# EAGLE design SupergunBasic (EAGLE 9.4.0)
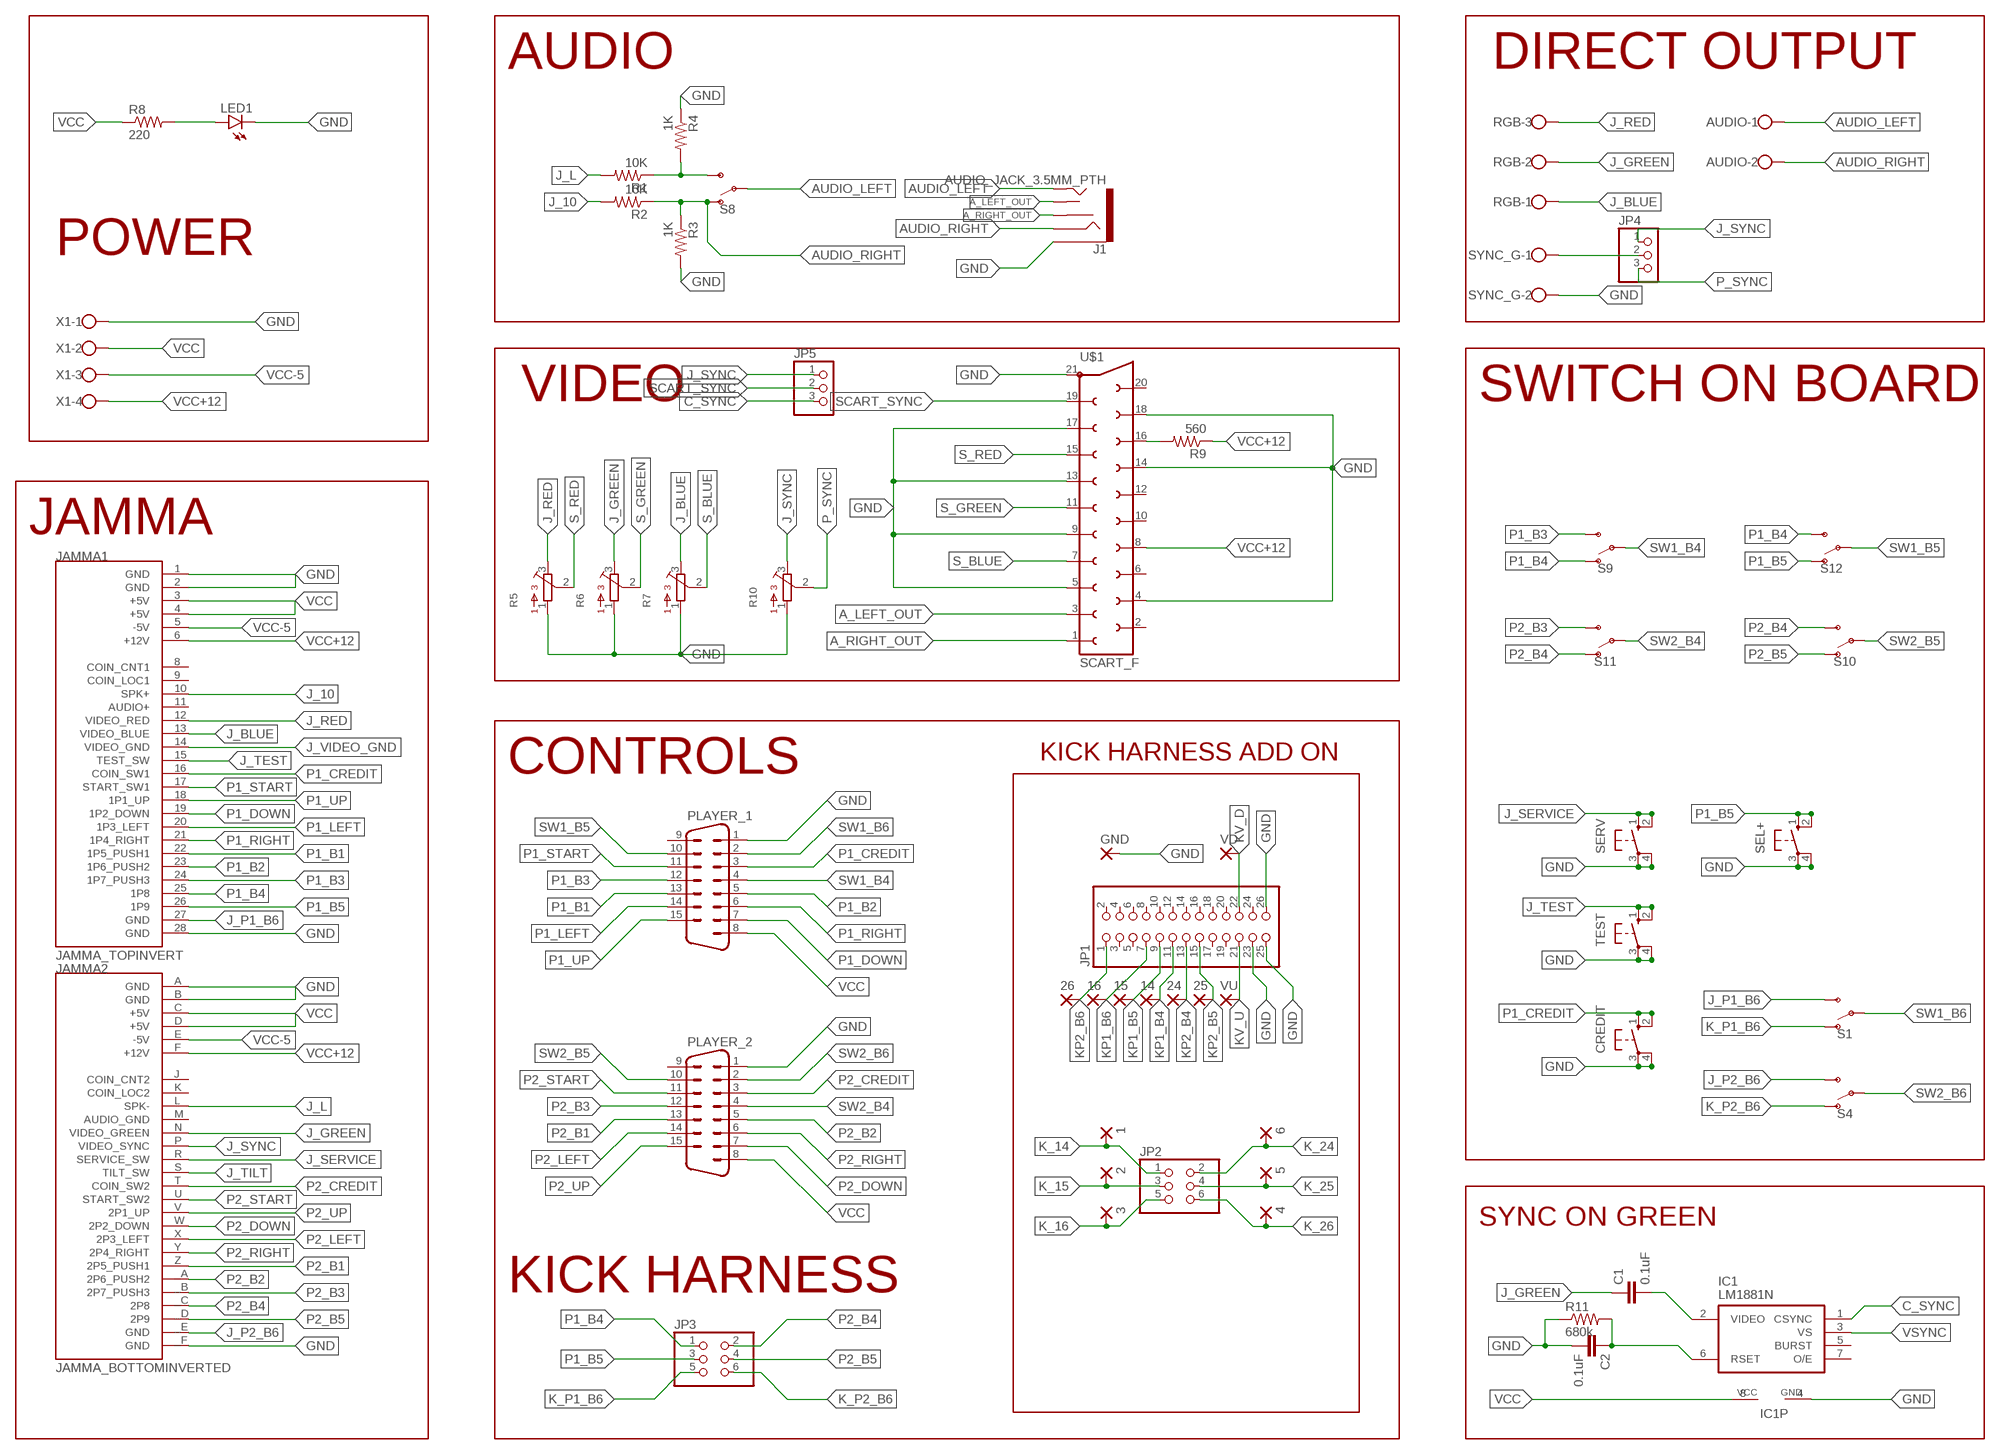
[diagram p0: schematic, sheet 1]

## Parts
1  SMD2  [SMD1,27-2,54]
2  SMD2  [SMD1,27-2,54]
3  SMD2  [SMD1,27-2,54]
4  SMD2  [SMD1,27-2,54]
5  SMD2  [SMD1,27-2,54]
6  SMD2  [SMD1,27-2,54]
14  SMD2  [SMD1,27-2,54]
15  SMD2  [SMD1,27-2,54]
16  SMD2  [SMD1,27-2,54]
24  SMD2  [SMD1,27-2,54]
25  SMD2  [SMD1,27-2,54]
26  SMD2  [SMD1,27-2,54]
AUDIO  W237-102  [W237-102]
C1  0.1uF  0.1UF-KIT-EZ-50V-20%  [CAP-PTH-SMALL-KIT]
C2  0.1uF  0.1UF-KIT-EZ-50V-20%  [CAP-PTH-SMALL-KIT]
CREDIT  10-XX  [B3F-10XX]
GND  SMD2  [SMD1,27-2,54]
IC1  LM1881N  [DIL08]
J1  AUDIO_JACK_3.5MM_PTH  [AUDIO-JACK]
JAMMA1  JAMMA_TOPINVERT  [JAMMA_TOP_INV]
JAMMA2  JAMMA_BOTTOMINVERTED  [JAMMA_BOTTOM_INV]
JP1  PINHD-2X13  [2X13]
JP2  PINHD-2X3  [2X03]
JP3  PINHD-2X3  [2X03]
JP4  PINHD-1X3  [1X03]
JP5  PINHD-1X3  [1X03]
LED1  LEDLD260  [LD260]
PLAYER_1  M15HP  [M15HP]
PLAYER_2  M15HP  [M15HP]
R1  10K  R-US_0204/7  [0204/7]
R2  10K  R-US_0204/7  [0204/7]
R3  1K  R-US_0204/7  [0204/7]
R4  1K  R-US_0204/7  [0204/7]
R5  3362P  [3362P]
R6  3362P  [3362P]
R7  3362P  [3362P]
R8  220  R-US_0204/7  [0204/7]
R9  560  R-US_0204/7  [0204/7]
R10  3362P  [3362P]
R11  680k  R-US_0204/7  [0204/7]
RGB  W237-103  [W237-103]
S1  SWITCH-SPDT-PTH-11.6X4.0MM  [SWITCH_SPDT_PTH_11.6X4.0MM]
S4  SWITCH-SPDT-PTH-11.6X4.0MM  [SWITCH_SPDT_PTH_11.6X4.0MM]
S8  SWITCH-SPDT-PTH-11.6X4.0MM  [SWITCH_SPDT_PTH_11.6X4.0MM]
S9  SWITCH-SPDT-PTH-11.6X4.0MM  [SWITCH_SPDT_PTH_11.6X4.0MM]
S10  SWITCH-SPDT-PTH-11.6X4.0MM  [SWITCH_SPDT_PTH_11.6X4.0MM]
S11  SWITCH-SPDT-PTH-11.6X4.0MM  [SWITCH_SPDT_PTH_11.6X4.0MM]
S12  SWITCH-SPDT-PTH-11.6X4.0MM  [SWITCH_SPDT_PTH_11.6X4.0MM]
SEL+  10-XX  [B3F-10XX]
SERV  10-XX  [B3F-10XX]
SYNC_G  W237-102  [W237-102]
TEST  10-XX  [B3F-10XX]
U$1  SCART_F  [SCART_F]
VD  SMD2  [SMD1,27-2,54]
VU  SMD2  [SMD1,27-2,54]
X1  W237-4  [W237-4]

## Nets
A_LEFT_OUT: J1.TSH U$1.3
A_RIGHT_OUT: J1.RSH U$1.1
AUDIO_LEFT: AUDIO.1 J1.TIP S8.2(P)
AUDIO_RIGHT: AUDIO.2 J1.RING R2.1 R3.1 S8.1(O)
C_SYNC: IC1.1(CSYNC) JP5.3
DIRECT_SYNC: JP4.2 SYNC_G.1
GND [GND]: C2.2 CREDIT.3(P) CREDIT.4(P1) GND.1(P) IC1.4(GND) J1.SLEEVE JAMMA1.1(GND) JAMMA1.2(GND) JAMMA1.28(GND) JAMMA2._F(GND) JAMMA2.A(GND) JAMMA2.B(GND) JP1.23 JP1.25 JP1.26 LED1.K(C) PLAYER_1.1 PLAYER_2.1 R3.2 R4.1 R5.1 R6.1 R7.1 R10.1 R11.1 SEL+.3(P) SEL+.4(P1) SERV.3(P) SERV.4(P1) SYNC_G.2 TEST.3(P) TEST.4(P1) U$1.4 U$1.5 U$1.9 U$1.13 U$1.14 U$1.17 U$1.18 U$1.21 X1.1
J_10: JAMMA1.10(SPK+) R2.2
J_BLUE: JAMMA1.13(VIDEO_BLUE) R7.3 RGB.1
J_GREEN: C1.1 JAMMA2.N(VIDEO_GREEN) R6.3 RGB.2
J_L: JAMMA2.L(SPK-) R1.2
J_P1_B6: JAMMA1.27(GND) S1.3(S)
J_P2_B6: JAMMA2._E(GND) S4.3(S)
J_RED: JAMMA1.12(VIDEO_RED) R5.3 RGB.3
J_SERVICE: JAMMA2.R(SERVICE_SW) SERV.1(S) SERV.2(S1)
J_SYNC: JAMMA2.P(VIDEO_SYNC) JP4.1 JP5.1 R10.3
J_TEST: JAMMA1.15(TEST_SW) TEST.1(S) TEST.2(S1)
J_TILT: JAMMA2.S(TILT_SW)
J_VIDEO_GND [GND]: JAMMA1.14(VIDEO_GND)
K_14: 1.1(P) JP2.1
K_15: 2.1(P) JP2.3
K_16: 3.1(P) JP2.5
K_24: 6.1(P) JP2.2
K_25: 5.1(P) JP2.4
K_26: 4.1(P) JP2.6
K_P1_B6: JP3.5 S1.1(O)
K_P2_B6: JP3.6 S4.1(O)
KP1_B4: 14.1(P) JP1.11
KP1_B5: 15.1(P) JP1.9
KP1_B6: 16.1(P) JP1.7
KP2_B4: 24.1(P) JP1.13
KP2_B5: 25.1(P) JP1.15
KP2_B6: 26.1(P) JP1.1
KV_D: JP1.22 VD.1(P)
KV_U: JP1.21 VU.1(P)
N$2: LED1.A R8.2
N$4: C2.1 IC1.6(RSET) R11.2
N$5: C1.2 IC1.2(VIDEO)
P1_B1: JAMMA1.22(1P5_PUSH1) PLAYER_1.13
P1_B2: JAMMA1.23(1P6_PUSH2) PLAYER_1.5
P1_B3: JAMMA1.24(1P7_PUSH3) PLAYER_1.12 S9.3(S)
P1_B4: JAMMA1.25(1P8) JP3.1 S9.1(O) S12.3(S)
P1_B5: JAMMA1.26(1P9) JP3.3 S12.1(O) SEL+.1(S) SEL+.2(S1)
P1_CREDIT: CREDIT.1(S) CREDIT.2(S1) JAMMA1.16(COIN_SW1) PLAYER_1.3
P1_DOWN: JAMMA1.19(1P2_DOWN) PLAYER_1.7
P1_LEFT: JAMMA1.20(1P3_LEFT) PLAYER_1.14
P1_RIGHT: JAMMA1.21(1P4_RIGHT) PLAYER_1.6
P1_START: JAMMA1.17(START_SW1) PLAYER_1.11
P1_UP: JAMMA1.18(1P1_UP) PLAYER_1.15
P2_B1: JAMMA2.Z(2P5_PUSH1) PLAYER_2.13
P2_B2: JAMMA2._A(2P6_PUSH2) PLAYER_2.5
P2_B3: JAMMA2._B(2P7_PUSH3) PLAYER_2.12 S11.3(S)
P2_B4: JAMMA2._C(2P8) JP3.2 S10.3(S) S11.1(O)
P2_B5: JAMMA2._D(2P9) JP3.4 S10.1(O)
P2_CREDIT: JAMMA2.T(COIN_SW2) PLAYER_2.3
P2_DOWN: JAMMA2.W(2P2_DOWN) PLAYER_2.7
P2_LEFT: JAMMA2.X(2P3_LEFT) PLAYER_2.14
P2_RIGHT: JAMMA2.Y(2P4_RIGHT) PLAYER_2.6
P2_START: JAMMA2.U(START_SW2) PLAYER_2.11
P2_UP: JAMMA2.V(2P1_UP) PLAYER_2.15
P_SYNC: JP4.3 R10.2
S_BLUE: R7.2 U$1.7
S_GREEN: R6.2 U$1.11
S_RED: R5.2 U$1.15
SCART_FAST_SW: R9.2 U$1.16
SCART_SYNC: JP5.2 U$1.19
STR_LEFT: R1.1 R4.2 S8.3(S)
SW1_B4: PLAYER_1.4 S9.2(P)
SW1_B5: PLAYER_1.10 S12.2(P)
SW1_B6: PLAYER_1.2 S1.2(P)
SW2_B4: PLAYER_2.4 S11.2(P)
SW2_B5: PLAYER_2.10 S10.2(P)
SW2_B6: PLAYER_2.2 S4.2(P)
VCC [VCC]: IC1.8(VCC) JAMMA1.3(+5V) JAMMA1.4(+5V) JAMMA2.C(+5V) JAMMA2.D(+5V) PLAYER_1.8 PLAYER_2.8 R8.1 X1.2
VCC+12 [VCC+12]: JAMMA1.6(+12V) JAMMA2.F(+12V) R9.1 U$1.8 X1.4
VCC-5 [VCC-5]: JAMMA1.5(-5V) JAMMA2.E(-5V) X1.3
VSYNC: IC1.3(VS)
Unconnected: IC1.5(BURST) IC1.7(O/E) JAMMA1.8(COIN_CNT1) JAMMA1.9(COIN_LOC1) JAMMA1.11(AUDIO+) JAMMA2.J(COIN_CNT2) JAMMA2.K(COIN_LOC2) JAMMA2.M(AUDIO_GND) JP1.2 JP1.3 JP1.4 JP1.5 JP1.6 JP1.8 JP1.10 JP1.12 JP1.14 JP1.16 JP1.17 JP1.18 JP1.19 JP1.20 JP1.24 PLAYER_1.9 PLAYER_2.9 U$1.2 U$1.6 U$1.10 U$1.12 U$1.20

## Notes on the sheet
- AUDIO | DIRECT OUTPUT
- POWER
- VIDEO | SWITCH ON BOARD
- JAMMA
- KICK HARNESS ADD ON
- CONTROLS
- SYNC ON GREEN
- KICK HARNESS

## Library data of the parts
1-6 14-16 24-26 GND VD VU = wirepad:SMD2: SMD PAD
AUDIO SYNC_G = con-wago-500:W237-102: WAGO SCREW CLAMP; MPN: 237-102; OC_FARNELL: unknown; OC_NEWARK: 70K9898
C1 C2 = SparkFun-Capacitors:0.1UF: 0.1µF ceramic capacitors A capacitor is a passive two-terminal electrical component used to store electrical energy temporarily in an electric field.; PROD_ID: CAP-08370
CREDIT SEL+ SERV TEST = switch-omron:10-XX: OMRON SWITCH; MPN: B3F-1000; OC_FARNELL: 176432; OC_NEWARK: 36M3542
IC1 = oldchips2:LM1881: Video sync separator
J1 = SparkFun-Connectors:AUDIO_JACK_3.5MM: Audio Jack 3.5mm variants of PTH and SMT stereo audio jack with bypass switches. SparkFun Products: SparkFun SparkPunk Sound Kit <[https://www.sparkfun.com/products/11177]> - PTH MP3 Trigger <https://www.sparkfun.com/products/13720> -3.5mm SMD SparkFun PicoBoard <https://www.sparkfun.com/products/11888>- 2.5mm SMD; PROD_ID: CONN-08774; SF_ID: PRT-08032
JAMMA1 = JAMMA_2:JAMMA_TOP: JAMMA Connector Top Parts side for these card-edge connenctors HIROSE CR7E-56DA-3.96E HIROSE CR7E-56DB-3.96E KEL 1168-056-009
JAMMA2 = JAMMA_2:JAMMA_BOTTOM: JAMMA Connector Bottom Solder side for these card-edge connenctors HIROSE CR7E-56DA-3.96E HIROSE CR7E-56DB-3.96E KEL 1168-056-009
JP1 = pinhead:PINHD-2X13: PIN HEADER
JP2 JP3 = pinhead:PINHD-2X3: PIN HEADER
JP4 JP5 = pinhead:PINHD-1X3: PIN HEADER
LED1 = led:LED: LED OSRAM: - CHIPLED LG R971, LG N971, LY N971, LG Q971, LY Q971, LO R971, LY R971 LH N974, LH R974 LS Q976, LO Q976, LY Q976 LO Q996 - Hyper CHIPLED LW Q18S LB Q993, LB Q99A, LB R99A - SideLED LS A670, LO A670, LY A670, LG A670, LP A670 LB A673, LV A673, LT A673, LW A673 LH A674 LY A675 LS A676, LA A676, LO A676, LY A676, LW A676 LS A679, LY A679, LG A679 - Hyper Micro SIDELED® LS Y876, LA Y876, LO Y876, LY Y876 LT Y87S - SmartLED LW L88C, LW L88S LB L89C, LB L89S, LG L890 LS L89K, LO L89K, LY L89K LS L896, LA L896, LO L896, LY L896 - TOPLED LS T670, LO T670, LY T670, LG T670, LP T670 LSG T670, LSP T670, LSY T670, LOP T670, LYG T670 LG T671, LOG T671, LSG T671 LB T673, LV T673, LT T673, LW T673 LH T674 LS T676, LA T676, LO T676, LY T676, LB T676, LH T676, LSB T676, LW T676 LB T67C, LV T67C, LT T67C, LS T67K, LO T67K, LY T67K, LW E67C LS E67B, LA E67B, LO E67B, LY E67B, LB E67C, LV E67C, LT E67C LW T67C LS T679, LY T679, LG T679 LS T770, LO T770, LY T770, LG T770, LP T770 LB T773, LV T773, LT T773, LW T773 LH T774 LS E675, LA E675, LY E675, LS T675 LS T776, LA T776, LO T776, LY T776, LB T776 LHGB T686 LT T68C, LB T68C - Hyper Mini TOPLED® LB M676 - Mini TOPLED Santana® LG M470 LS M47K, LO M47K, LY M47K Source: http://www.osram.convergy.de LUXEON: - LUMILED® LXK2-PW12-R00, LXK2-PW12-S00, LXK2-PW14-U00, LXK2-PW14-V00 LXK2-PM12-R00, LXK2-PM12-S00, LXK2-PM14-U00 LXK2-PE12-Q00, LXK2-PE12-R00, LXK2-PE12-S00, LXK2-PE14-T00, LXK2-PE14-U00 LXK2-PB12-K00, LXK2-PB12-L00, LXK2-PB12-M00, LXK2-PB14-N00, LXK2-PB14-P00, LXK2-PB14-Q00 LXK2-PR12-L00, LXK2-PR12-M00, LXK2-PR14-Q00, LXK2-PR14-R00 LXK2-PD12-Q00, LXK2-PD12-R00, LXK2-PD12-S00 LXK2-PH12-R00, LXK2-PH12-S00 LXK2-PL12-P00, LXK2-PL12-Q00, LXK2-PL12-R00 Source: www.luxeon.com KINGBRIGHT: KA-3528ASYC Source: www.kingbright.com
PLAYER_1 PLAYER_2 = con-subd:M15: SUB-D; OC_FARNELL: unknown; OC_NEWARK: unknown
R1-R4 R8 R9 R11 = adafruit:R-US_: RESISTOR, American symbol
R5-R7 R10 = bourns:3362: 3362 Series 1/4" Square Trimmer
RGB = con-wago-500:W237-103: WAGO SCREW CLAMP; MPN: 237-103; OC_FARNELL: unknown; OC_NEWARK: 18M7116
S1 S4 S8-S12 = SparkFun-Switches:SWITCH-SPDT: Single Pole, Double Throw (SPDT) Switch Single-pole, double-throw (SPDT) switch. Variant Overview SMD-AYZ0202 Surface Mount DPDT Switch <https://www.sparkfun.com/products/597> (COM-00597) Used on e.g. LilyPad Arduino USB - ATmega32U4 Board <https://www.sparkfun.com/products/12049> PTH-11.6X4.0MM SPDT Mini Power Switch <https://www.sparkfun.com/products/102> (COM-00102) Used on e.g. SparkFun Simon Says - Through-Hole Soldering Kit <https://www.sparkfun.com/products/10547> (KIT-10547) PTH-11.6X4.0MM-KIT KIT version of SPDT Mini Power Switch - Simplifies soldering by removing tStop of switch pins - only one side can be soldered. PTH-11.6X4.0MM-LOCK LOCK version of SPDT Mini Power Switch - Offset pins hold switch in place for easier soldering. SMD-RIGHT-ANGLE Surface Mount Right Angle Switch <https://www.sparkfun.com/products/10860> (COM-10860) Used on e.g. SparkFun ESP8266 Thing <https://www.sparkfun.com/products/13231>; PROD_ID: SWCH-08261; SF_SKU: COM-00102
U$1 = scart:SCART_F
X1 = con-wago-500:W237-4: WAGO SCREW CLAMP; OC_FARNELL: unknown; OC_NEWARK: unknown

## Net classes
0 Default: width 0.152 mm
1 VCC: width 0.762 mm
2 VCC-5: width 0.762 mm
3 VCC+12: width 0.762 mm
4 GND: width 0.762 mm

## Board
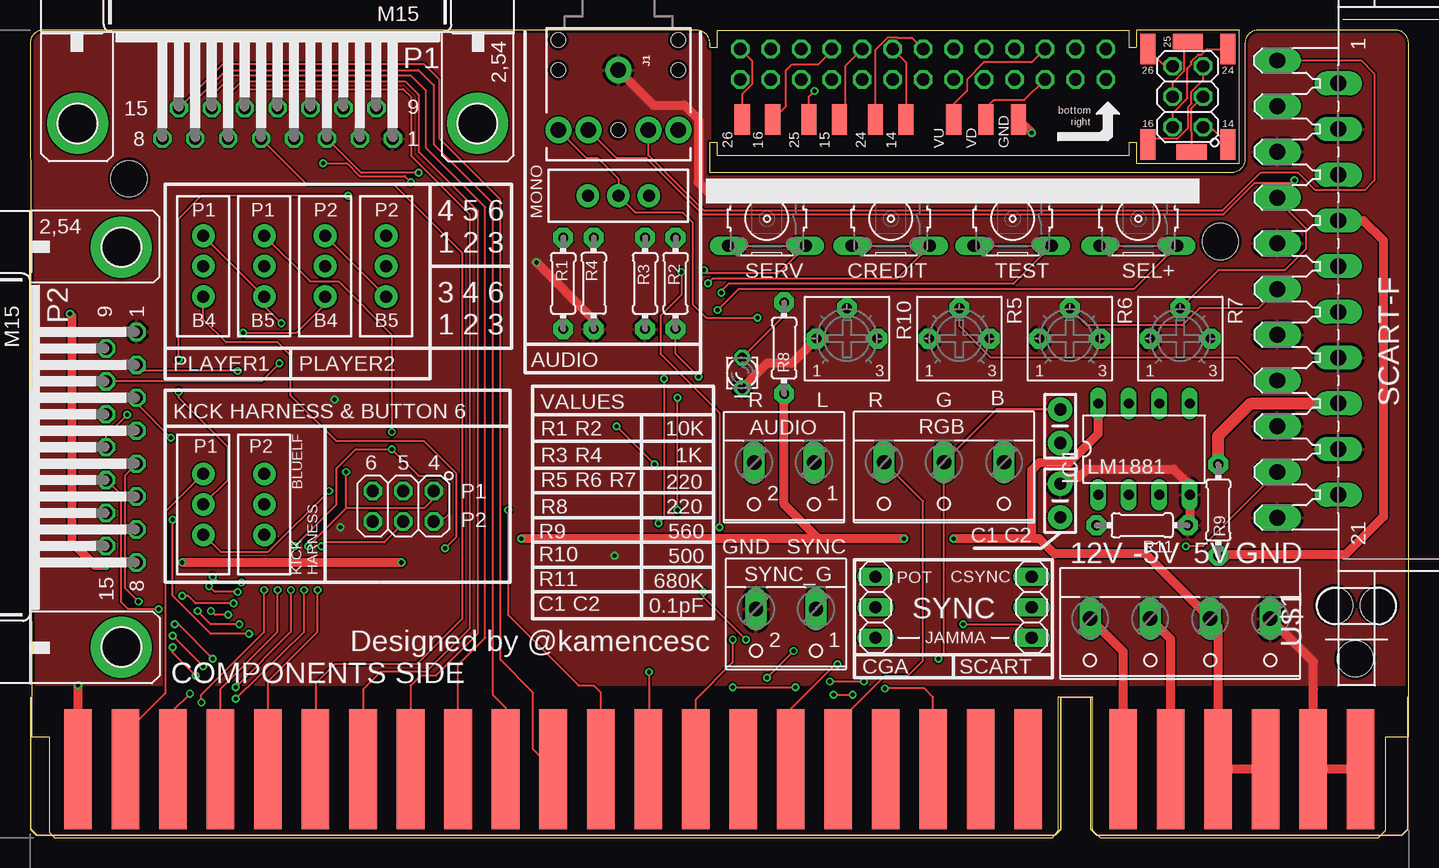
[diagram p1: board, top side]
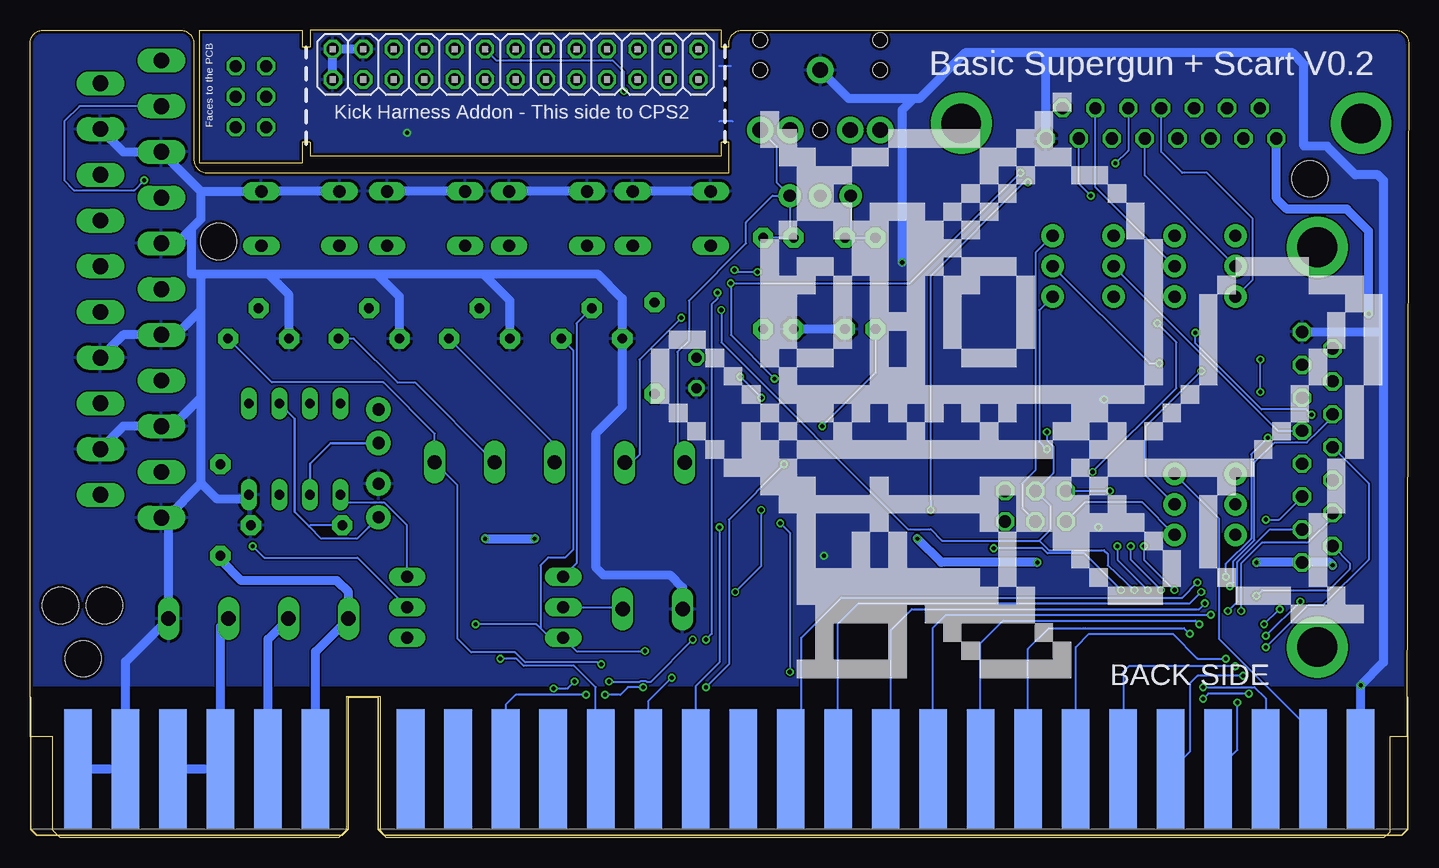
[diagram p2: board, bottom side, seen from below]

Size 114.94 x 67.31 mm. Coordinates in mm from the lower left corner, seen from the top.
Outline: 1.59,0.48 2.06,0 85.25,0 85.72,0.64 85.72,11.75 88.58,11.75 88.58,0.64 89.22,0 112.39,0 113.03,0.64 113.03,8.41 114.94,8.41 114.94,66.17 arc90 113.79,67.31 102.42,67.31 arc90 101.28,66.17 101.28,56.55 arc-90 100.14,55.4 56.67,55.4 56.67,57.94 57.31,57.94 57.31,56.83 91.6,56.83 91.6,57.94 92.23,57.94 92.23,56.2 100.81,56.2 100.81,67.31 92.23,67.31 92.23,65.88 91.6,65.88 91.6,67.31 57.31,67.31 57.31,65.88 56.67,65.88 56.67,66.17 arc90 55.53,67.31 1.14,67.31 arc90 0,66.17 0.16,8.41 1.59,8.41 1.59,0.48
Copper layers (1*16): Top 0.035mm / dielectric 1.5mm / Bottom 0.035mm
Design rules "dirtypcbs_2_layer": minimum track width 5mil, minimum drill 12mil, track to track 5mil, track to pad 5mil, pad to pad 5mil, via to via 5mil, smd to smd 0mil, copper to edge 10mil, drill to drill 10mil, minimum pad ring 10mil, minimum via ring 6mil, stop-mask expansion 2mil, vias tented up to drill 25mil, thermal gap 10mil
Holes 3.02 mm at 108.74,19.37 112.39,19.37
Holes 3 mm at 8.26,54.93 99.22,49.69 110.49,14.92

### Footprints (pad centres in the part's own frame; a part is rotated, then mirrored left to right if it is on the bottom)
SMD1,27-2,54 = smd 1.27 x 2.54: 1 0,0
W237-102 = drill 1.194 long: 1 -2.5,-1.27; 2 2.5,-1.27
CAP-PTH-SMALL-KIT = drill 1.016 pad 2.032: 1 -1.397,0; 2 1.397,0
B3F-10XX = drill 1.016 long: 1 -3.251,2.261; 2 3.251,2.261; 3 -3.251,-2.261; 4 3.251,-2.261
DIL08 = drill 0.813 long: 1 -3.81,-3.81; 2 -1.27,-3.81; 3 1.27,-3.81; 4 3.81,-3.81; 5 3.81,3.81; 6 1.27,3.81; 7 -1.27,3.81; 8 -3.81,3.81
AUDIO-JACK = drill 1.3 pad 2.184: RING 5,5; RSH 5,2.5; SLEEVE 0,0; TIP 5,-5; TSH 5,-2.5 | hole 1.2: 0,5; -2.5,5; -2.5,-5; 0,-5; 5,0
JAMMA_TOP_INV = smd 2.3 x 10: 1 57.27,0; 2 53.31,0; 3 49.35,0; 4 45.39,0; 5 41.43,0; 6 37.47,0; 8 29.55,0; 9 25.59,0; 10 21.63,0; 11 17.67,0; 12 13.71,0; 13 9.75,0; 14 5.79,0; 15 1.83,0; 16 -2.13,0; 17 -6.09,0; 18 -10.05,0; 19 -14.01,0; 20 -17.97,0; 21 -21.93,0; 22 -25.89,0; 23 -29.85,0; 24 -33.81,0; 25 -37.77,0; 26 -41.73,0; 27 -45.69,0; 28 -49.65,0
JAMMA_BOTTOM_INV = smd 2.3 x 10 bottom: _A -29.85,0; _B -33.81,0; _C -37.77,0; _D -41.73,0; _E -45.69,0; _F -49.65,0; A 57.27,0; B 53.31,0; C 49.35,0; D 45.39,0; E 41.43,0; F 37.47,0; J 29.55,0; K 25.59,0; L 21.63,0; M 17.67,0; N 13.71,0; P 9.75,0; R 5.79,0; S 1.83,0; T -2.13,0; U -6.09,0; V -10.05,0; W -14.01,0; X -17.97,0; Y -21.93,0; Z -25.89,0
2X13 = drill 1.016 octagon: 1 -15.24,-1.27; 2 -15.24,1.27; 3 -12.7,-1.27; 4 -12.7,1.27; 5 -10.16,-1.27; 6 -10.16,1.27; 7 -7.62,-1.27; 8 -7.62,1.27; 9 -5.08,-1.27; 10 -5.08,1.27; 11 -2.54,-1.27; 12 -2.54,1.27; 13 0,-1.27; 14 0,1.27; 15 2.54,-1.27; 16 2.54,1.27; 17 5.08,-1.27; 18 5.08,1.27; 19 7.62,-1.27; 20 7.62,1.27; 21 10.16,-1.27; 22 10.16,1.27; 23 12.7,-1.27; 24 12.7,1.27; 25 15.24,-1.27; 26 15.24,1.27
2X03 = drill 1.016 octagon: 1 -2.54,-1.27; 2 -2.54,1.27; 3 0,-1.27; 4 0,1.27; 5 2.54,-1.27; 6 2.54,1.27
1X03 = drill 1.016 long: 1 -2.54,0; 2 0,0; 3 2.54,0
LD260 = drill 0.813 octagon: A -1.27,0; K 1.27,0
M15HP = drill 1.016 octagon: 1 -9.601,1.27; 2 -6.858,1.27; 3 -4.115,1.27; 4 -1.372,1.27; 5 1.372,1.27; 6 4.115,1.27; 7 6.858,1.27; 8 9.601,1.27; 9 -8.23,-1.27; 10 -5.486,-1.27; 11 -2.743,-1.27; 12 0,-1.27; 13 2.743,-1.27; 14 5.486,-1.27; 15 8.23,-1.27 | drill 3.302 pad 5.08: G1 -16.662,0; G2 16.662,0
0204/7 = drill 0.813 pad 1.676 octagon: 1 -3.81,0; 2 3.81,0
3362P = drill 0.813 pad 1.676 octagon: 1 -2.54,0; 2 0,2.54; 3 2.54,0
W237-103 = drill 1.194 long: 1 -5,-1.29; 2 0,-1.29; 3 5,-1.29
SWITCH_SPDT_PTH_11.6X4.0MM = drill 1.016 pad 1.88: 1 0,2.54; 2 0,0; 3 0,-2.54
SCART_F = drill 1.321 long: 1 19.05,5.08; 2 17.145,0; 3 15.24,5.08; 4 13.335,0; 5 11.43,5.08; 6 9.525,0; 7 7.62,5.08; 8 5.715,0; 9 3.81,5.08; 10 1.905,0; 11 0,5.08; 12 -1.905,0; 13 -3.81,5.08; 14 -5.715,0; 15 -7.62,5.08; 16 -9.525,0; 17 -11.43,5.08; 18 -13.335,0; 19 -15.24,5.08; 20 -17.145,0; 21 -19.05,5.08
W237-4 = drill 1.194 long: 1 -7.5,-1.27; 2 -2.5,-1.27; 3 2.5,-1.27; 4 7.5,-1.27

### Placement (x,y rotation side)
1  99.85,57.78 180 top
2  96.84,57.15 270 top
3  93.19,57.78 180 top
4  93.19,65.72 0 top
5  96.52,66.36 270 top
6  99.85,65.72 0 top
14  73.03,59.85 0 top
15  67.47,59.85 0 top
16  61.91,59.85 0 top
24  70.48,59.85 0 top
25  64.93,59.85 0 top
26  59.37,59.85 0 top
AUDIO  62.87,30 180 top
C1  85.88,34.29 270 top
C2  85.88,28.1 90 top
CREDIT  71.75,51.59 180 top
GND  82.39,59.85 0 top
IC1  92.87,32.38 0 top
J1  49.05,63.98 270 top
JAMMA1  53.66,5.71 0 top
JAMMA2  53.66,5.71 0 top
JP1  74.45,64.45 180 bottom
JP2  96.52,61.75 90 top
JP3  31.11,27.62 180 top
JP4  70.48,19.21 90 top
JP5  83.5,19.21 90 top
LED1  59.37,38.73 270 top
PLAYER_1  20.64,59.53 180 top
PLAYER_2  7.62,32.54 270 top
R1  44.45,46.2 270 top
R2  53.82,46.2 270 top
R3  51.28,46.2 270 top
R4  46.99,46.2 90 top
R5  77.47,41.59 0 top
R6  86.68,41.59 0 top
R7  95.89,41.59 0 top
R8  62.87,40.8 90 top
R9  99.06,27.3 90 top
R10  68.1,41.59 0 top
R11  92.71,26.04 180 top
RGB  76.2,30 180 top
S1  14.45,27.78 180 top
S4  19.53,27.78 180 top
S8  49.05,53.5 270 top
S9  14.45,47.62 0 top
S10  29.69,47.62 0 top
S11  24.61,47.62 0 top
S12  19.53,47.62 0 top
SEL+  92.39,51.59 180 top
SERV  61.44,51.59 180 top
SYNC_G  63.02,17.78 180 top
TEST  81.92,51.59 180 top
U$1  109.06,45.72 90 top
VD  79.69,59.85 0 top
VU  76.99,59.85 0 top
X1  95.89,16.99 180 top

### Tracks (layer width: path | path; a pad name or v marks a point on that pad's centre or on a via)
A_LEFT_OUT  (via drill 0.35)
  Top 0.152: J1.TSH 48.86,56.67 51.36,56.67 56.08,51.95 99.49,51.95 102.08,54.53 105.16,54.53 v105.41,54.78
  Bottom 0.152: U$1.3 110.81,60.96 112.08,59.69 112.08,54.77 111.28,53.98 106.22,53.98 v105.41,54.78
A_RIGHT_OUT
  Top 0.152: U$1.1 110.97,64.77 112.08,63.66 112.08,54.77 111.28,53.98 107.16,53.98 105.73,55.4 102.55,55.4 99.38,52.23 56.2,52.23 51.55,56.87 J1.RSH
AUDIO_LEFT  (via drill 0.35)
  Top 0.152: J1.TIP 46.36,56.67 47.31,56.67 49.05,54.93 S8.2 50.48,52.07 54.45,52.07 55.24,51.28 55.24,44.45 56.36,43.34 v60.64,43.34
  Bottom 0.152: v60.64,43.34 64.14,39.85 64.14,31.91 64.73,31.31 65.33,31.31 AUDIO.1
AUDIO_RIGHT
  Bottom 0.152: J1.RING 52.7,57.63 52.7,54.61 S8.1 | S8.1 51.59,50.32 R3.1 R2.1 | S8.1 53.02,53.5 55.24,51.28 55.24,49.53 60.01,44.77 60.01,41.43 60.96,40.48 60.96,31.87 AUDIO.2
C_SYNC
  Bottom 0.152: IC1.1 88.41,27.92 85.38,27.92 83.5,26.05 JP5.3
DIRECT_SYNC
  Bottom 0.152: JP4.2 65.68,19.21 SYNC_G.1
GND  (via drill 0.35)
  Top 0.762: X1.1 107,14.64 107,12.38 106.97,12.35 JAMMA2.B JAMMA2.A | JAMMA2._F v4.01,12.7 | J1.SLEEVE 51.98,61.05 54.56,61.05 55.72,59.89 55.72,54.61 56.48,53.85 SERV.4 | SERV.3 CREDIT.4 | CREDIT.3 TEST.4 | TEST.3 SEL+.4 | v42.23,47.94 46.99,43.18 R4.1 | C2.2 86.45,30.07 87.44,30.07 88.1,30.72 95.33,30.72 96.68,29.37 IC1.4 96.68,26.19 R11.1 | R10.1 63.5,39.53 61.44,39.53 LED1.K | GND.1 v83.5,58.74
  Bottom 0.152: 56.52,64.29 57.47,64.29 | 56.36,59.69 57.47,59.69
  Bottom 0.762: SERV.4 SERV.3 | CREDIT.4 CREDIT.3 | TEST.4 TEST.3 | SEL+.4 SEL+.3 100.69,53.85 | U$1.4 107.16,57.15 U$1.5 100.69,53.85 | 100.69,53.85 100.69,51.56 101.48,50.76 | 101.48,50.76 102.71,49.53 U$1.9 | 101.48,50.76 101.48,46.99 100.69,46.99 | 100.69,46.99 100.69,43.97 | 100.69,43.97 102.75,41.91 U$1.13 107.16,41.91 U$1.14 | 100.69,43.97 100.69,36.67 | 100.69,36.67 100.69,29.53 | 100.69,29.53 103.54,26.67 U$1.21 103.39,26.07 X1.1 106.97,14.67 JAMMA2.B JAMMA2.A | 100.69,36.67 103.07,34.29 U$1.17 107.16,34.29 U$1.18 | R4.1 R3.2 | 100.69,46.99 95.09,46.99 | 95.09,46.99 86.04,46.99 | 86.04,46.99 77.15,46.99 | 77.15,46.99 67.63,46.99 65.56,44.93 R10.1 65.56,35.88 67.79,33.66 67.79,22.54 67.15,21.91 61.59,21.91 60.52,20.84 SYNC_G.2 | R5.1 74.93,44.77 77.15,46.99 | R6.1 84.14,45.09 86.04,46.99 | R7.1 93.34,45.24 95.09,46.99 | JAMMA2._F v4.01,12.7 2.1,14.61 2.1,42.15 | PLAYER_2.1 2.1,42.15 | 30.16,65.41 9.68,65.41 8.73,64.45 8.73,57.63 6.83,57.63 4.45,55.24 2.58,55.24 2.1,54.77 2.1,42.15 | PLAYER_1.1 30.24,65.33 30.16,65.41 | 41.27,61.59 40.8,61.59 36.99,65.41 30.16,65.41 | 41.27,61.59 46.67,61.59 J1.SLEEVE | JP1.23 JP1.25 JP1.26 | 41.27,61.59 42.23,60.64 v42.23,47.94 | 100.69,29.53 100.65,29.53 99.38,28.26 97,28.26 IC1.4
  other vias: 25.4,36.51 25.88,25.88 48.74,23.5
  pour Bottom: 57.15,56.2 57.15,67.31 100.81,67.31 100.81,56.2
  pour Bottom: 56.67,68.1 56.67,55.4 101.28,55.4 101.28,67.31 114.94,67.31 114.94,12.7 0.16,12.7 0.16,68.1
  pour Top: 56.67,68.1 56.67,55.4 101.28,55.4 101.28,67.31 114.94,67.31 114.94,12.7 0.16,12.7 0.16,68.1
J_10  (via drill 0.35)
  Top 0.152: JAMMA1.10 75.29,11.71 74.56,12.44 v71.28,12.44 | v69.53,13.02 v66.67,13.02 | v59.69,16.51 56.14,20.06 v56.14,20.48 | v53.98,27.3 v53.98,36.67 | v55.72,38.42 53.82,40.32 R2.2
  Bottom 0.152: v71.28,12.44 70.11,12.44 v69.53,13.02 | v59.69,16.51 63.18,13.02 63.54,13.02 63.6,13.07 64.04,13.07 64.09,13.02 v66.67,13.02 | v56.14,20.48 53.98,22.65 v53.98,27.3 | v53.98,36.67 v55.72,38.42
J_BLUE  (via drill 0.35)
  Top 0.152: JAMMA1.13 63.41,10.7 67.15,14.45 v67.31,14.45
  Bottom 0.152: R7.3 94.77,37.94 85.47,37.94 81.2,33.67 RGB.1 79.3,29.39 79.3,16.59 78.16,15.45 74.51,15.45 73.66,14.61 67.63,14.61 67.47,14.45 v67.31,14.45
J_GREEN  (via drill 0.35)
  Top 0.152: v75.72,14.92 76.2,15.4 RGB.2
  Top 0.203: RGB.2 80.59,35.69 C1.1
  Bottom 0.152: RGB.2 82.85,37.94 84.3,37.94 87.95,41.59 R6.3 | JAMMA2.N 67.79,6.13 67.79,12.54 69.57,14.33 73.78,14.33 74.37,14.92 v75.72,14.92
J_L  (via drill 0.35)
  Top 0.152: v48.9,34.29 v52.07,31.11 | v58.58,12.54 v63.82,12.54 | v66.99,11.91 v68.58,11.91
  Bottom 0.152: R1.2 44.45,38.73 v48.9,34.29 | v52.07,31.11 56.67,26.51 56.67,14.45 v58.58,12.54 | v63.82,12.54 65.09,12.54 65.72,11.91 v66.99,11.91 | v68.58,11.91 74.45,11.91 75.29,11.07 JAMMA2.L
J_P1_B6
  Top 0.152: S1.3 11.27,27.15 11.27,12.04 7.97,8.73 JAMMA1.27
J_P2_B6
  Bottom 0.152: S4.3 15.82,26.62 15.82,16.59 7.97,8.73 JAMMA2._E
J_RED
  Top 0.152: JAMMA1.12 67.79,6.13 67.79,10 71.28,13.49 73.18,13.49 74.45,14.76 74.45,28.04 RGB.3
  Bottom 0.152: R5.3 71.2,32.78 RGB.3
J_SERVICE  (via drill 0.35)
  Top 0.152: SERV.2 SERV.1 62.39,47.03 56.47,47.03 v56.2,47.31 | v54.29,47.15 54.29,45.24 52.55,43.5 52.55,40.32 57.47,35.4 v57.47,25.88
  Bottom 0.152: v56.2,47.31 56.04,47.15 v54.29,47.15 | v57.47,25.88 57.47,14.61 59.45,12.62 JAMMA2.R
J_SYNC  (via drill 0.35)
  Top 0.152: v63.66,15.56 v61.44,13.34 | v77.79,17.78 82.39,17.78 JP5.1
  Bottom 0.152: R10.3 69.65,40.6 69.65,24.01 70.33,23.34 71.75,23.34 72.39,22.7 72.39,17.46 | 72.39,17.46 71.91,16.99 70.8,16.99 JP4.1 69.37,15.56 v63.66,15.56 | v61.44,13.34 63.41,11.36 JAMMA2.P | 72.39,17.46 72.71,17.78 v77.79,17.78
J_TEST  (via drill 0.35)
  Top 0.152: TEST.2 TEST.1 81.99,46.16 58.22,46.16 57.63,45.56 v57.63,45.4 | v58.58,16.51 58.58,14.61 55.49,11.51 JAMMA1.15
  Bottom 0.152: v57.63,45.4 57.63,44.93 58.1,44.45 58.1,16.99 v58.58,16.51
K_14
  Top 0.152: JP2.1 98.42,59.21 1.1
K_15
  Top 0.152: 2.1 96.84,58.8 96.83,58.81 96.83,60.79 JP2.3
K_16
  Top 0.152: JP2.5 97.79,63.12 96.83,62.15 96.83,61.18 96.55,60.9 96.55,59.14 95.65,58.25 95.57,58.25 93.65,58.25 3.1
K_24
  Top 0.152: JP2.2 95.25,60.39 96.5,61.63 96.5,64.11 96.83,64.44 96.83,64.69 97.39,65.26 97.64,65.26 98.11,65.72 6.1
K_25
  Top 0.152: JP2.4 95.25,62.93 96.22,63.89 96.22,66.05 5.1
K_26
  Top 0.152: JP2.6 94.61,64.29 4.1
K_P1_B6  (via drill 0.35)
  Top 0.152: S1.1 15.88,23.81 19.84,23.81 v24.92,28.89
  Bottom 0.152: v24.92,28.89 JP3.5
K_P2_B6
  Bottom 0.152: S4.1 22.23,27.94 26.99,27.94 JP3.6
KP1_B4
  Top 0.152: JP1.11 73.03,64.61 14.1
KP1_B5
  Top 0.152: JP1.9 67.94,64.29 67.94,60.33 15.1
KP1_B6
  Top 0.152: 16.1 63.02,60.96 63.02,63.98 63.5,64.45 65.72,64.45 66.83,65.56 JP1.7
KP2_B4
  Top 0.152: 24.1 70.48,65.66 71.51,66.69 72.31,66.69 72.33,66.67 73.5,66.67 JP1.13
KP2_B5  (via drill 0.35)
  Top 0.152: 25.1 64.93,61.75 v65.41,62.23
  Bottom 0.152: v65.41,62.23 65.41,63.82 66.34,64.76 76.03,64.76 JP1.15
KP2_B6
  Top 0.152: 26.1 59.37,61.98 60.18,62.78 60.18,64.76 JP1.1
KV_D
  Top 0.152: VD.1 79.69,60.8 80.33,61.44 82.87,61.44 JP1.22
KV_U
  Top 0.152: JP1.21 83.5,64.61 79.53,64.61 78.11,63.18 78.11,62.23 76.99,61.12 VU.1
N$2
  Top 0.152: R8.2 62.87,43.5 LED1.A
N$4
  Bottom 0.152: 86.71,25.88 87.66,24.92 90.65,24.92 91.68,25.96 91.6,26.04 R11.2
  Bottom 0.203: IC1.6 92.87,34.92 92.87,27.15 91.68,25.96 | C2.1 86.71,25.88
N$5
  Bottom 0.203: C1.2 89.85,32.89 91.6,31.15 IC1.2
P1_B1
  Top 0.152: PLAYER_1.13 17.94,60.85 17.94,61.91 18.41,62.39 31.11,62.39 31.75,61.75 31.75,56.83 36.67,51.91 36.67,17.46 33.02,13.81 29.21,13.81 27.78,12.38 27.78,5.73 JAMMA1.22
P1_B2
  Top 0.152: PLAYER_1.5 23.08,54.45 30.32,54.45 36.04,48.74 36.04,18.26 32.23,14.45 25.4,14.45 23.81,12.85 JAMMA1.23
P1_B3  (via drill 0.35)
  Top 0.152: JAMMA1.24 19.85,13.02 23.97,17.14 v23.97,20.64 | v34.61,24.13 35.56,25.08 35.56,30.32 32.86,33.02 25.56,33.02 21.75,36.83 21.75,40.16 20.64,41.27 16.35,41.27 14.45,43.18 S9.3
  Bottom 0.152: S9.3 13.02,46.51 13.02,51.59 16.83,55.4 18.89,55.4 20.64,57.15 PLAYER_1.12 | v23.97,20.64 27.03,23.69 30.12,23.69 30.56,24.13 v34.61,24.13
P1_B4  (via drill 0.35)
  Top 0.152: S9.1 S12.3 19.53,44.29 v20.95,42.86 | JAMMA1.25 15.89,12.39 20.64,17.14 v20.64,20.64 | 26.35,27.46 32.86,27.46 33.66,28.26 JP3.1 | v23.18,24.29 26.35,27.46 | 26.35,27.46 v26.35,30.48
  Bottom 0.152: v20.64,20.64 23.18,23.18 v23.18,24.29 | v26.35,30.48 19.37,37.47 19.37,41.27 v20.95,42.86
P1_B5  (via drill 0.35)
  Top 0.152: SEL+.1 95.62,49.31 | 95.62,49.31 92.03,45.72 59.05,45.72 v57.31,43.97 | SEL+.2 95.61,49.33 95.62,49.31 | JAMMA1.26 11.93,10.6 v13.34,12.01 | v17.14,11.59 22.86,17.14 v22.86,20.64 | S12.1 23.34,46.35 25.72,46.35 30.16,41.91 v30.16,33.81
  Bottom 0.152: v57.31,43.97 57.31,41.27 41.75,25.72 39.85,25.72 38.89,24.77 30.8,24.77 | 30.8,24.77 29.84,25.72 29.84,27.62 JP3.3 29.63,30.38 29.63,32.6 30.16,33.13 v30.16,33.81 | 30.8,24.77 30,23.97 25.4,23.97 25.08,23.65 25.08,22.7 v22.86,20.64 | v13.34,12.01 16.72,12.01 v17.14,11.59
P1_CREDIT  (via drill 0.35)
  Top 0.152: CREDIT.2 CREDIT.1 72.27,46.6 56.91,46.6 v56.52,46.2 | v32.38,55.4 27.61,55.4 PLAYER_1.3 | v52.86,38.26 52.86,26.67 v52.39,26.19 | v51.59,13.81 51.59,5.78 JAMMA1.16
  Bottom 0.152: v32.38,55.4 41.59,46.2 v56.52,46.2 56.52,41.91 v52.86,38.26 | v52.39,26.19 51.59,25.4 v51.59,13.81
P1_DOWN
  Top 0.152: PLAYER_1.7 13.78,61.4 16.35,63.98 32.38,63.98 33.66,62.71 33.66,57.78 38.58,52.86 38.58,11.91 39.65,10.84 JAMMA1.19
P1_LEFT
  Top 0.152: PLAYER_1.14 15.15,61.82 16.83,63.5 31.75,63.5 33.02,62.23 33.02,57.47 37.94,52.55 37.94,16.67 35.69,14.41 JAMMA1.20
P1_RIGHT
  Top 0.152: PLAYER_1.6 16.52,61.91 17.63,63.02 31.27,63.02 32.38,61.91 32.38,57.15 37.31,52.23 37.31,16.99 33.81,13.49 32.54,13.49 31.73,12.68 JAMMA1.21
P1_START  (via drill 0.35)
  Top 0.152: v24.45,56.2 26.42,56.2 27.49,55.12 31.24,55.12 v31.75,54.61 | v39.85,27.3 39.85,18.57 45.72,12.7 46.99,12.7 47.57,12.12 JAMMA1.17
  Bottom 0.152: PLAYER_1.11 23.38,57.26 v24.45,56.2 | v31.75,54.61 32.07,54.61 39.85,46.83 39.84,28.09 v39.85,27.3
P1_UP
  Top 0.152: PLAYER_1.15 16.06,64.45 32.86,64.45 34.13,63.18 34.13,58.26 39.21,53.18 39.21,14.81 41.95,12.07 41.95,7.37 JAMMA1.18
P2_B1  (via drill 0.35)
  Top 0.152: v15.24,14.92 12.38,17.78 v12.06,17.78 | v10.74,19.05 8.2,19.05 7.62,19.63 7.62,28.57 6.39,29.8 PLAYER_2.13
  Bottom 0.152: JAMMA2.Z 27.77,15.89 26.67,16.99 19.68,16.99 17.62,14.92 v15.24,14.92 | v12.06,17.78 10.79,19.05 v10.74,19.05
P2_B2  (via drill 0.35)
  Top 0.152: v14.45,14.29 v11.91,16.83 | v9.05,19.68 7.92,20.81 7.92,28.83 7.94,28.84 7.94,30.22 PLAYER_2.5
  Bottom 0.152: v14.45,14.29 23.34,14.29 23.81,13.82 JAMMA2._A | v11.91,16.83 v9.05,19.68
P2_B3  (via drill 0.35)
  Top 0.152: PLAYER_2.12 6.35,33.5 v8.1,35.24 | v17.78,42.07 22.23,42.07 24.61,44.45 S11.3 | v13.81,13.49 11.91,15.4 v11.91,15.88
  Bottom 0.152: v8.1,35.24 8.55,35.69 12.28,35.69 17.78,41.19 v17.78,42.07 | PLAYER_2.12 3.33,29.53 3.33,23.18 7.14,19.37 8.41,19.37 v11.91,15.88 | JAMMA2._B 19.68,5.72 18.26,7.14 18.26,12.86 17.62,13.49 v13.81,13.49
P2_B4  (via drill 0.35)
  Top 0.152: S11.1 S10.3 | v22.07,24.29 25.56,27.78 25.56,30.8 27.15,32.38 v30.16,32.38 32.38,30.16 34.29,30.16 34.92,29.53 34.92,26.99 34.29,26.35 JP3.2 | v19.53,20.64 19.53,17.14 14.29,11.91 v14.29,11.27
  Bottom 0.152: S10.3 30.8,43.97 30.8,32.98 30.2,32.38 v30.16,32.38 | v22.07,24.29 22.07,23.18 v19.53,20.64 | JAMMA2._C 14.29,7.32 v14.29,11.27
P2_B5  (via drill 0.35)
  Top 0.152: JP3.4 31.11,26.19 29.53,24.61 24.61,24.61 v24.29,24.29 | v21.75,20.64 21.75,17.14 v17.14,12.54
  Bottom 0.152: S10.1 31.11,48.74 31.11,30.64 32.23,29.53 32.23,27.46 JP3.4 | v24.29,24.29 24.29,23.18 v21.75,20.64 | v17.14,12.54 12.86,12.54 11.93,11.61 JAMMA2._D
P2_CREDIT  (via drill 0.35)
  Top 0.152: v17.62,21.27 15.72,21.27 v15.24,21.75 | v11.75,33.34 8.89,36.2 PLAYER_2.3
  Bottom 0.152: JAMMA2.T 50.64,6.6 50.64,16.67 47.31,20 18.89,20 v17.62,21.27 | v11.75,33.34 13.13,31.95 13.13,24.92 15.24,22.82 v15.24,21.75
P2_DOWN  (via drill 0.35)
  Top 0.152: v16.51,18.57 15.4,18.57 v15.08,18.89
  Bottom 0.152: JAMMA2.W 39.65,17.5 38.58,18.57 v16.51,18.57 | v15.08,18.89 14.29,19.68 14.29,22.98 11.58,25.69 11.46,25.69 11.43,25.69 PLAYER_2.7
P2_LEFT  (via drill 0.35)
  Top 0.152: v17.46,17.78 15.08,17.78 v13.97,18.89
  Bottom 0.152: JAMMA2.X 35.69,16.22 33.81,18.1 17.78,18.1 v17.46,17.78 | PLAYER_2.14 6.35,26.67 8.41,24.61 12.22,24.61 13.97,22.86 v13.97,18.89
P2_RIGHT  (via drill 0.35)
  Top 0.152: v18.26,16.99 15.08,16.99 11.91,20.16 v11.91,26.51
  Bottom 0.152: JAMMA2.Y 31.73,15.74 30,17.46 27.15,17.46 26.99,17.46 18.73,17.46 v18.26,16.99 | v11.91,26.51 10.81,26.51 PLAYER_2.6
P2_START  (via drill 0.35)
  Top 0.152: v17.3,20.48 15.4,20.48 v14.92,20.95
  Bottom 0.152: JAMMA2.U 47.57,17.84 45.88,19.53 18.26,19.53 v17.3,20.48 | v14.92,20.95 14.61,21.27 14.61,23.06 12.85,24.81 12.85,31.28 11.18,32.95 8.49,32.95 7.47,33.97 7.46,33.97 6.35,35.08 PLAYER_2.11
P2_UP  (via drill 0.35)
  Top 0.152: v16.99,19.53 13.81,19.53 13.18,20.16 v12.7,20.16
  Bottom 0.152: JAMMA2.V 43.18,6.14 43.18,17.3 41.43,19.05 17.46,19.05 v16.99,19.53 | v12.7,20.16 12.22,20.64 6.67,20.64 4.92,22.38 4.92,22.89 PLAYER_2.15
P_SYNC
  Bottom 0.152: R10.2 69.37,42.86 69.37,22.86 JP4.3
S_BLUE
  Top 0.152: U$1.7 103.98,53.18 106.36,50.8 106.36,49.05 104.62,47.31 99.06,47.31 R7.2
S_GREEN
  Top 0.152: U$1.11 102.39,44.13 97.47,44.13 96.04,42.7 88.11,42.7 R6.2
S_RED
  Top 0.152: U$1.15 102.55,38.1 100.65,40.01 80.12,40.01 77.47,42.66 R5.2
SCART_FAST_SW
  Top 1.016: R9.2 99.06,33.5 101.72,36.16 109.02,36.16 U$1.16
SCART_SYNC  (via drill 0.35)
  Top 0.152: U$1.19 97.79,24.29 v96.36,24.29
  Bottom 0.152: v96.36,24.29 95.41,23.34 87.63,23.34 JP5.2
STR_LEFT
  Bottom 0.152: S8.3 46.51,50.48 R4.2 R1.1
SW1_B4
  Bottom 0.152: S9.2 22.01,55.19 PLAYER_1.4
SW1_B5
  Bottom 0.152: S12.2 26.12,54.22 PLAYER_1.10
SW1_B6  (via drill 0.35)
  Top 0.152: S1.2 16.51,29.84 16.51,32.54 12.38,36.67 v12.38,37.15 | v12.38,39.85 12.38,51.59 14.29,53.5 v26.51,53.5
  Bottom 0.152: v12.38,37.15 v12.38,39.85 | v26.51,53.5 27.5,54.48 PLAYER_1.2
SW2_B4
  Bottom 0.152: S11.2 10.9,33.91 PLAYER_2.4
SW2_B5  (via drill 0.35)
  Top 0.152: v20.8,39.53 19.3,38.03 PLAYER_2.10
  Bottom 0.152: S10.2 21.59,39.53 v20.8,39.53
SW2_B6  (via drill 0.35)
  Top 0.152: v17.3,38.89 9.4,38.89 PLAYER_2.2
  Bottom 0.152: S4.2 21.91,30.16 21.91,34.29 v17.3,38.89
VCC  (via drill 0.35)
  Top 0.762: JAMMA2.C JAMMA2.D 99.05,17.59 X1.2 92.99,23.65 85.41,23.65 84.14,24.92 83.5,24.92 | v72.87,24.92 65.72,24.92 | 65.72,24.92 v40.96,24.92 | 83.5,24.92 v76.99,24.92 | v12.7,22.94 v30.96,22.94 | v3.33,43.66 3.49,43.5 3.49,24.61 5.4,22.7 v6.35,22.7 | 83.5,24.92 83.5,30.64 84.14,31.27 86.68,31.27 89.06,33.66 IC1.8 | 65.72,24.92 62.87,27.78 R8.1
  Bottom 0.762: X1.2 99.05,17.59 JAMMA2.D JAMMA2.C | v76.99,24.92 v72.87,24.92 | v12.7,22.94 PLAYER_2.8 6.59,22.94 v6.35,22.7 | v30.96,22.94 38.98,22.94 v40.96,24.92 | v3.33,43.66 3.33,50.56 5.16,52.39 10.16,52.39 11.04,53.26 PLAYER_1.8
VCC+12
  Top 0.762: JAMMA2.F 91.13,15.51 X1.4 | U$1.8 111.16,51.44 112.82,49.78 112.82,26.74 109.67,23.58 99.15,23.58 R9.1
  Bottom 0.762: JAMMA2.F 91.13,15.51 X1.4 88.39,20.48 89.34,21.43 97.31,21.43 99.06,23.18 R9.1
VCC-5
  Top 0.762: JAMMA2.E 95.09,16.55 X1.3
  Bottom 0.762: JAMMA2.E 95.09,16.55 X1.3

### Text on the board
tPlace: 25 | 26 | 24 | 16 | 14 | bottom / right | 15 | P1 | P1 | P2 | P2 | MONO | B4 | B5 | B4 | B5 | P1 | P2 | LM1881 | C1 C2 | GND | POT | CSYNC | C1 | C2 | 0.1pF | SYNC | JAMMA | CGA | SCART
bPlace: Faces to the PCB
tNames: P1 | 4 5 6 / 1 2 3 | P2 | 3 4 6 / 1 2 3 | PLAYER1 | PLAYER2 | AUDIO | VALUES | R | L | R | G | B | KICK HARNESS & BUTTON 6 | R1 | R2 | 10K | 6 | 5 | 4 | R3 | R4 | 1K | BLUELF | R5 | R6 | R7 | 220 | P1 | R8 | 220 | P2 | R9 | 560 | GND | SYNC | R10 | 500 | 12V | -5V | 5V | KICK / HARNESS | R11 | 680K | Designed by @kamencesc | COMPONENTS SIDE
bNames: Basic Supergun + Scart V0.2 | Kick Harness Addon - This side to CPS2 | BACK SIDE